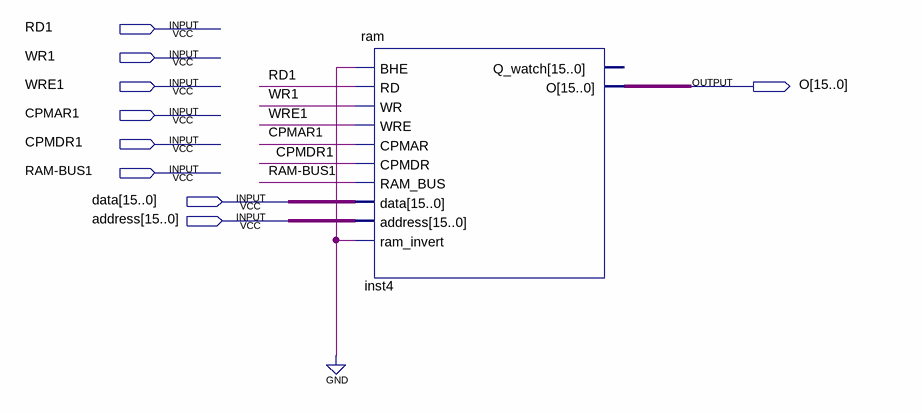
[diagram p0: schematic sheet]
// Quartus schematic ram_test.bdf as structural Verilog: 1 symbols, 9 pins
module ram_test (
  input  RD1,
  input  WR1,
  input  WRE1,
  input  CPMAR1,
  input  CPMDR1,
  input  \RAM-BUS1 ,
  input  [15:0] data,
  input  [15:0] address,
  output [15:0] O
);

  ram inst4 (
    .BHE(1'b0), .RD(RD1), .WR(WR1), .WRE(WRE1), .CPMAR(CPMAR1), .CPMDR(CPMDR1), .RAM_BUS(\RAM-BUS1 ),
    .data(data), .address(address), .ram_invert(1'b0), .O(O));  // open: Q_watch
endmodule
